# Altium schematic sheet MCU and CAN2.SchDoc: Power Distribution Board
size A4; DocumentNumber: V2; SheetNumber: 1; SheetTotal: 1
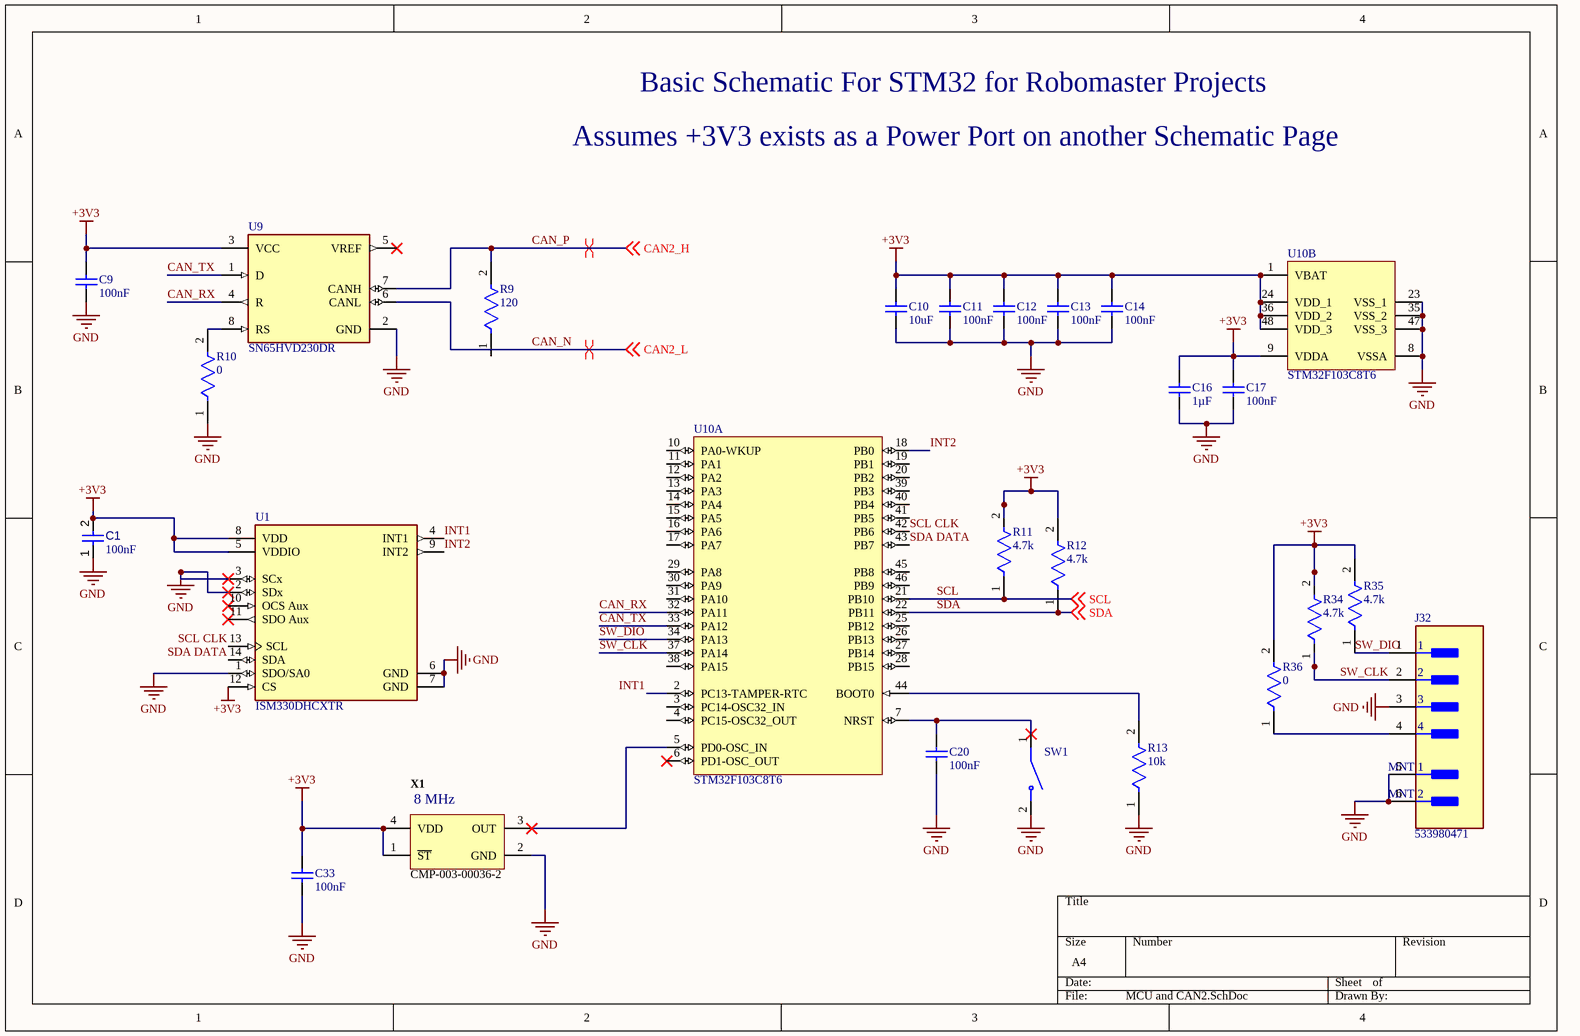
[diagram p0: MCU and CAN2.SchDoc]

## Parts
C1  value 100nF  [CAPC0402(1005)60_L]  (hidden comment: Capacitor 100nF +/-20% 10V 0402)
C9  100nF  [CAPC1608X92X38NL15T08]
C10  10uF  [CAPC1608X92X38NL15T08]
C11  100nF  [CAPC1608X92X38NL15T08]
C12  100nF  [CAPC1608X92X38NL15T08]
C13  100nF  [CAPC1608X92X38NL15T08]
C14  100nF  [CAPC1608X92X38NL15T08]
C16  1µF  [CAPC1608X92X38NL15T08]
C17  100nF  [CAPC1608X92X38NL15T08]
C20  100nF  [CAPC1608X92X38NL15T08]
C33  100nF  [CAPC1608X92X38NL15T08]
J32  533980471  [FP-533980471-MFG]
R9  120  [FP-AC0603-MFG]
R10  0  [FP-AC0603-MFG]
R11  4.7k  [FP-AC0603-MFG]
R12  4.7k  [FP-AC0603-MFG]
R13  10k  [FP-AC0603-MFG]
R34  4.7k  [FP-AC0603-MFG]
R35  4.7k  [FP-AC0603-MFG]
R36  0  [FP-AC0603-MFG]
SW1  (no value)  [SW_TS-1088-AR02016]
U1  ISM330DHCXTR  [FP-LGA-14L-DM00249496-MFG]
U9  SN65HVD230DR  [FP-D0008A-IPC_A]
U10  STM32F103C8T6  [STM-LQFP48_L]  (parts A,B of 2)
X1  CMP-003-00036-2  [X1G004481001412-Footprint-1]

## Nets
+3V3: C1.2 C9.2 C10.2 C11.2 C12.2 C13.2 C14.2 C16.2 C17.2 C33.2 R11.2 R12.2 R34.2 R35.2 R36.2 U1.5(VDDIO) U1.8(VDD) U1.12(CS) U9.3(VCC) U10.1(VBAT) U10.9(VDDA) U10.24(VDD_1) U10.36(VDD_2) U10.48(VDD_3) X1.1(~{ST}) X1.4(VDD)
GND: C1.1 C9.1 C10.1 C11.1 C12.1 C13.1 C14.1 C16.1 C17.1 C20.1 C33.1 J32.3 J32.5(MNT_1) J32.6(MNT_2) R10.1 R13.1 SW1.2 U1.1(SDO/SA0) U1.2(SDx) U1.3(SCx) U1.6(GND) U1.7(GND) U9.2(GND) U10.8(VSSA) U10.23(VSS_1) U10.35(VSS_2) U10.47(VSS_3) X1.2(GND)
CAN_N: U9.6(CANL) ; off-sheet CAN2_L  [also labelled CAN2_L]
CAN_P: R9.2 U9.7(CANH) ; off-sheet CAN2_H  [also labelled CAN2_H]
CAN_RX: U9.4(R) U10.32(PA11)
CAN_TX: U9.1(D) U10.33(PA12)
INT1: U1.4(INT1) U10.2(PC13-TAMPER-RTC)
INT2: U1.9(INT2) U10.18(PB0)
SCL: R11.1 U10.21(PB10) ; off-sheet SCL
SCL CLK: U1.13(SCL) U10.42(PB6)
SDA: R12.1 U10.22(PB11) ; off-sheet SDA
SDA DATA: U1.14(SDA) U10.43(PB7)
SW_CLK: J32.2 R34.1 U10.37(PA14)
SW_DIO: J32.1 R35.1 U10.34(PA13)
NetC20_2: C20.2 SW1.1 U10.7(NRST)
NetJ32_4: J32.4 R36.1
NetR10_2: R10.2 U9.8(RS)
NetR13_2: R13.2 U10.44(BOOT0)
NetU10_5: U10.5(PD0-OSC_IN) X1.3(OUT)

Not connected (* = marked no-connect by the designer): R9 1; U1 10(OCS_Aux)* 11(SDO_Aux)*; U9 5(VREF)*; U10 3(PC14-OSC32_IN) 4(PC15-OSC32_OUT) 6(PD1-OSC_OUT)* 10(PA0-WKUP) 11(PA1) 12(PA2) 13(PA3) 14(PA4) 15(PA5) 16(PA6) 17(PA7) 19(PB1) 20(PB2) 25(PB12) 26(PB13) 27(PB14) 28(PB15) 29(PA8) 30(PA9) 31(PA10) 38(PA15) 39(PB3) 40(PB4) 41(PB5) 45(PB8) 46(PB9)

## Layout directives
differential pair: CAN_N, CAN_P

## Notes on the sheet
- Basic Schematic For STM32 for Robomaster Projects
- Assumes +3V3 exists as a Power Port on another Schematic Page
- (in symbol CMP-003-00032-1) 8 MHz

## Library data of the parts
C1 = CMP-001-00061-3: Chip Capacitor, 100nF +/-20%, 10V, 0402, Thickness 0.6 mm; Tolerance: 20%; Mounting Technology: SMT; Voltage Rating: 10V; Max Operating Temperature: 85°C; Pins: 2; Case/Package: 0402; Min Operating Temperature: -55°C
C9-C14 C16 C17 C20 C33 = CMP-2006-01140-1: Generic Capacitor 0603; Manufacturer: Generic; Value: *
J32 = CMP-04776-000105-1: CONN HEADER SMD 4POS 1.25MM; Manufacturer: Molex; Conn Gender: Male; Conn Orientation: Vertical; Standoff Height: 0.05mm; Number Of Contacts: 4; Current Rating: 1A; Voltage Rating: 125V; Package: 0; ComponentLink2Description: Datasheet; ComponentLink2URL: https://www.molex.com/pdm_docs/ps/PS-51021-024-001.pdf; Ambient Temperature Range Low: -40°C; Category: Conn; Automotive: No; Number Of Rows: 1; Device Class L3: unset; Ambient Temperature Range High: +105°C; Height: 5.1mm; Lead Free: Yes; Pitch: 1.25mm; Contact Material: Tin; Footprint Url: https://www.molex.com/pdm_docs/sd/533980471_sd.pdf; Octopart: https://octopart.com/53398-0471-molex-655296; Temperature Range Low: -40°C; Device Class L2: Headers and Wire Housings; Temperature: -40°C to +105°C; Digikey Description: CONN HEADER SMD 4POS 1.25MM; RoHS: TRUE; Manufacturer Part Number: 533980471; Device Class L1: Connectors; Temperature Range High: +105°C
R9-R13 R34-R36 = CMP-03412-004865-2: Generic RES 0603; Case/Package: 0603
  R9: Resistance: 120
  R10 R36: Resistance: 0
  R11 R12 R34 R35: Resistance: 4.7k
  R13: Resistance: 10k
SW1 = CMP-005-000000-1: 50mA 4mm 100MÎ© 100,000 Times 12V 160gf 3mm 2mm Round Button Vertical welding SPST SMD Tactile Switches ROHS; MF: Xunpu; Package: Package; Source: TS-1088-AR02016.SchLib; Check_prices: https://www.snapeda.com/parts/TS-1088-AR02016/Xunpu/view-part/?ref=eda; Component Type: Standard; Value: *; SnapEDA_Link: https://www.snapeda.com/parts/TS-1088-AR02016/Xunpu/view-part/?ref=snap; Design Item ID: TS-1088-AR02016; MP: TS-1088-AR02016; Pin Count: 2
U1 = CMP-12177-000014-1: INEMO INERTIAL MODULE: ALWAYS-ON
U9 = CMP-0315-00015-3: IC TRANSCEIVER HALF 1/1 8SOIC; Number of Transceivers: 1; Operating Supply Voltage: 3.3V; Number of I/Os: 2; Max Supply Current: 17mA; Max Supply Voltage: 3.6V; Min Supply Voltage: 3V; Data Rate: 1Mbps; Min Operating Temperature: -40°C; Packaging: Tape and Reel; Lead Free: Lead Free; Number of Transmit Buffers: 1; Max Operating Temperature: 85°C; Number of Receive Buffers: 1; Number of Pins: 8; Package Quantity: 1; Radiation Hardening: No; Case/Package: D; REACH SVHC: No SVHC; Weight: 0.002561oz; Termination: SMD/SMT; Contact Plating: Gold; Nominal Supply Current: 17mA; Number of Receivers: 1; Number of Drivers: 1
U10 = CMP-0237-00215-3: ARM Cortex-M3 32-bit MCU, 64 KB Flash, 20 KB Internal RAM, 37 I/Os, 48-pin LQFP, -40 to 85 degC, Tray; Supply Voltage(Vcc) min (V): 2; Internal RAM Size (kB): 20; FLASH Size (Prog) (kB): 64; A/D Converter: 2x12-bit (10 Channel); I/Os (High Current): 37; Operating Frequency(F) (Processor speed) (MHz): 72; Core: ARM Cortex-M3; ComponentLink3Description: Package Specification; Mounting Technology: Surface Mount; PartNumber: STM32F103C8T6; PackageReference: LQFP48; Packing: Tray; ComponentLink3URL: http://www.st.com/st-web-ui/static/active/en/resource/technical/document/datasheet/DM00058181.pdf; DatasheetVersion: Rev. 16; ComponentLink1URL: http://www.st.com/web/en/home.html; PackageVersion: Rev. 6, 06/2013; ComponentLink2URL: http://www.st.com/st-web-ui/static/active/en/resource/technical/document/datasheet/CD00161566.pdf; ComponentLink1Description: Manufacturer URL; ComponentLink2Description: Datasheet; PackageDescription: 48-Pin Low Profile Quad Flat Package, 7 x 7 mm Body, 0.5 mm Pitch
X1 = CMP-003-00032-1: Crystal Oscillator 8MHz 1.6V to 3.6V 15pF 4-Pin SMD T/R; Frequency: 8MHz; Pins: 4; Load Capacitance: 15pF; Max Operating Temperature: 85°C; Component Type: Standard; Mounting Technology: Surface Mount; Design Item ID: CMP-003-00036-2; Min Operating Temperature: -40°C; Source: Components - 07.02.26 - 15.45.SchLib